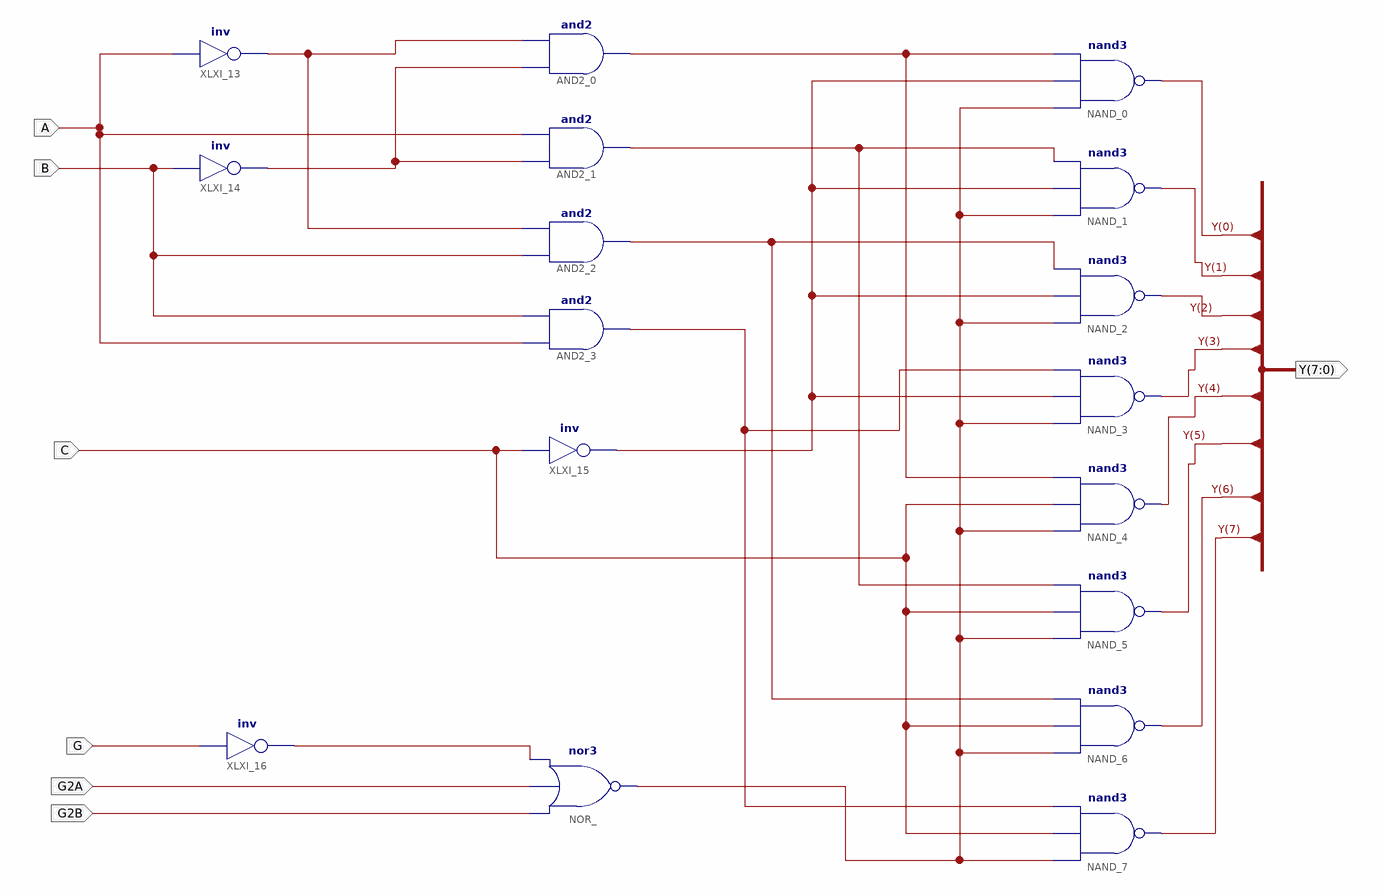
[diagram p0: schematic sheet 1]
// Xilinx ISE schematic D_74LS138.sch (kintex7) as structural Verilog: 17 symbols, 7 ports
module D_74LS138 (
  input  G,
  input  G2A,
  input  G2B,
  input  C,
  input  A,
  input  B,
  output [7:0] Y
);

  wire XLXN_67, XLXN_72, XLXN_76, XLXN_82, XLXN_85, XLXN_87, XLXN_89, XLXN_91, XLXN_100;

  nand NAND_0 (Y[0], XLXN_72, XLXN_76, XLXN_89);
  nand NAND_1 (Y[1], XLXN_72, XLXN_76, XLXN_87);
  nand NAND_2 (Y[2], XLXN_72, XLXN_76, XLXN_85);
  nand NAND_3 (Y[3], XLXN_72, XLXN_76, XLXN_82);
  nand NAND_4 (Y[4], XLXN_72, C, XLXN_89);
  nand NAND_5 (Y[5], XLXN_72, C, XLXN_87);
  nand NAND_6 (Y[6], XLXN_72, C, XLXN_85);
  nand NAND_7 (Y[7], XLXN_72, C, XLXN_82);
  and AND2_0 (XLXN_89, XLXN_100, XLXN_91);
  and AND2_1 (XLXN_87, XLXN_100, A);
  and AND2_2 (XLXN_85, B, XLXN_91);
  and AND2_3 (XLXN_82, A, B);
  not XLXI_13 (XLXN_91, A);
  not XLXI_14 (XLXN_100, B);
  not XLXI_15 (XLXN_76, C);
  not XLXI_16 (XLXN_67, G);
  nor NOR_ (XLXN_72, G2B, G2A, XLXN_67);
endmodule
